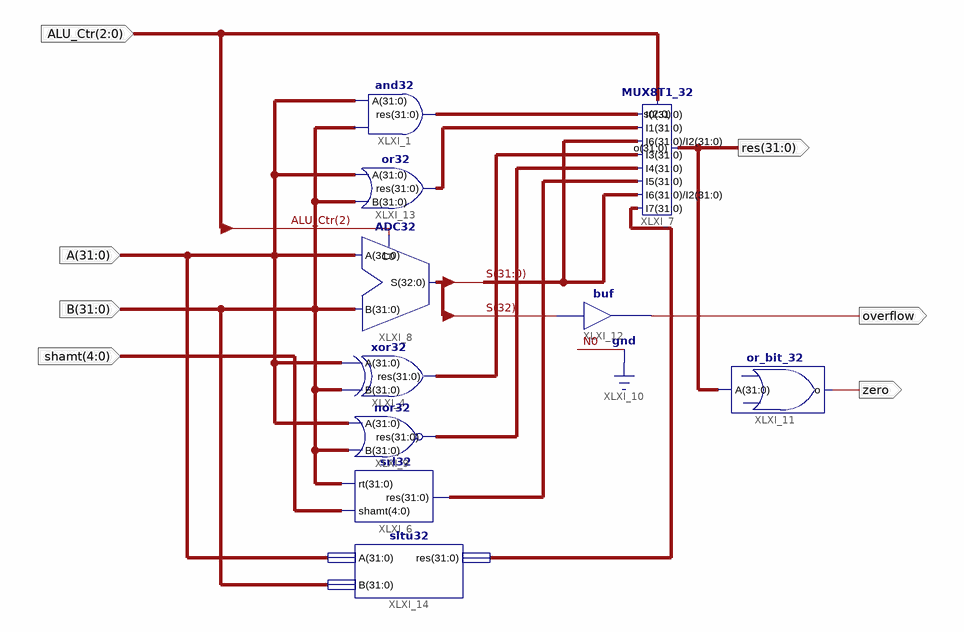
[diagram p0: schematic sheet 1]
// Xilinx ISE schematic ALU.sch (kintex7) as structural Verilog: 10 symbols, 7 ports
module ALU (
  input  [2:0] ALU_Ctr,
  input  [31:0] B,
  input  [4:0] shamt,
  input  [31:0] A,
  output [31:0] res,
  output zero,
  output overflow
);

  wire [31:0] XLXN_1, XLXN_4, XLXN_6, XLXN_7, XLXN_10, XLXN_11;
  wire [32:0] S;

  and32 XLXI_1 (.res(XLXN_1), .A(A), .B(B));
  xor32 XLXI_4 (.A(A), .B(B), .res(XLXN_4));
  srl32 XLXI_6 (.rt(B), .shamt(shamt), .res(XLXN_7));
  MUX8T1_32 XLXI_7 (
    .s(ALU_Ctr), .I7(XLXN_11), .I6(S[31:0]), .I5(XLXN_7), .I4(XLXN_6), .I3(XLXN_4), .I2(S[31:0]),
    .I1(XLXN_10), .I0(XLXN_1), .o(res));
  ADC32 XLXI_8 (.B(B), .A(A), .C0(ALU_Ctr[2]), .S(S));
  nor32 XLXI_9 (.res(XLXN_6), .A(A), .B(B));
  or_bit_32 XLXI_11 (.o(zero), .A(res));
  buf XLXI_12 (overflow, S[32]);
  or32 XLXI_13 (.A(A), .B(B), .res(XLXN_10));
  sltu32 XLXI_14 (.A(A), .B(B), .res(XLXN_11));
endmodule
